# EasyEDA schematic Sheet_1.json
TITLE: Sheet_1; REV: 1.0; Date: 2022-01-21; Sheet: 1/1; Drawn By: reutadm; Company: Your Company
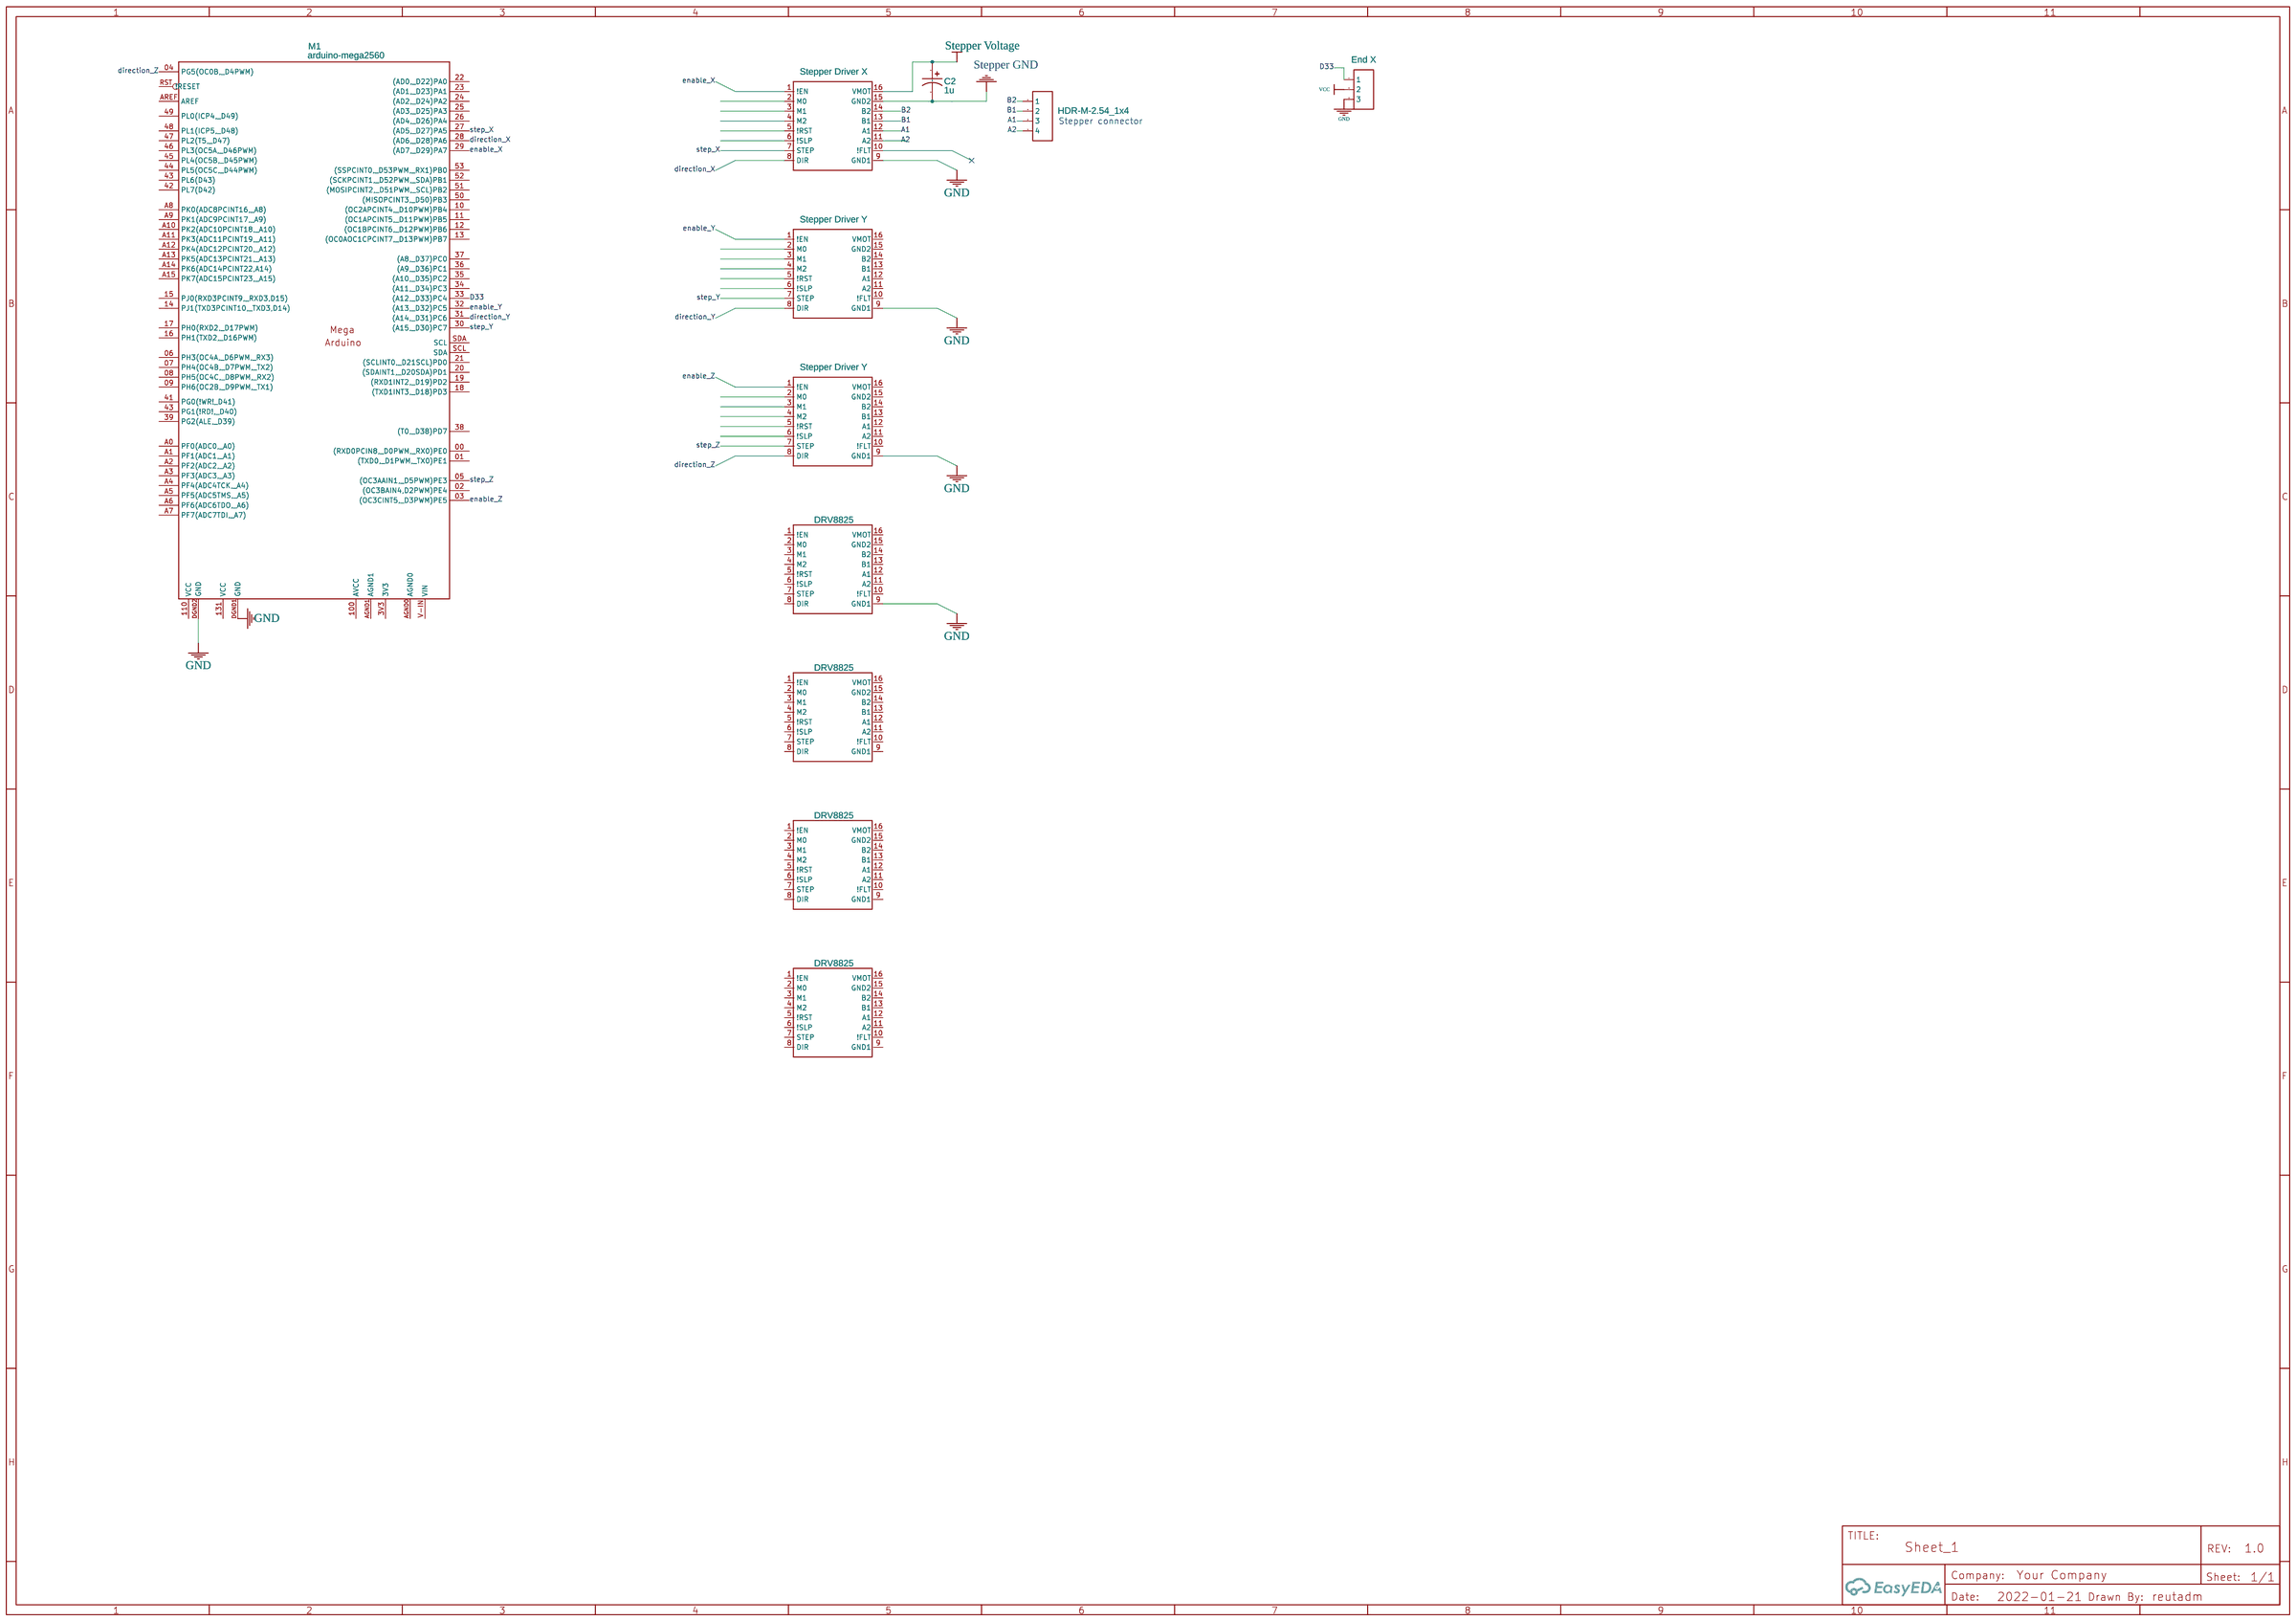
[diagram p0: schematic sheet]

## Parts
C2  1u  [CAP-D3.0×F1.5]
H1  End X  [HDR-F-2.54_1X3]
IC1  Stepper Driver X  [DRV8825]
IC2  Stepper Driver Y  [DRV8825]
IC3  Stepper Driver Y  [DRV8825]
IC4  DRV8825  [DRV8825]
IC5  DRV8825  [DRV8825]
IC6  DRV8825  [DRV8825]
IC7  DRV8825  [DRV8825]
J1  HDR-M-2.54_1x4  [HDR-M-2.54_1X4]
M1  arduino-mega2560  [ARDUINO-MEGA2560]

## Library data of the parts
C2 = CE_TH_D3.0×F1.5_US: Contributor: LCEDA_Lib
H1 = HDR-F-2.54_1x3: Supplier Part: C146690; Supplier: LCSC; Contributor: LCEDA_Lib
IC1-IC7 = 2133-DRV8825: Contributor: aidancor
J1 = HDR-M-2.54_1x4: Supplier Part: C124378; Supplier: LCSC; Contributor: LCEDA_Lib
M1 = arduino-mega2560: subpart_no: 1; Contributor: hg5cfj

## Nets
GND: H1.3 IC1.9(GND1) IC2.9(GND1) IC3.9(GND1) IC4.9(GND1) M1.DGND1(GND) M1.DGND2(GND)
VCC: H1.2
A1: IC1.12(A1) J1.3
A2: IC1.11(A2) J1.4
B1: IC1.13(B1) J1.2
B2: IC1.14(B2) J1.1
D33: H1.1 M1.33((A12, D33)PC4)
direction_X: IC1.8(DIR) M1.28((AD6, D28)PA6)
direction_Y: IC2.8(DIR) M1.31((A14, D31)PC6)
direction_Z: IC3.8(DIR) M1.04(PG5(OC0B, D4PWM))
enable_X: IC1.1(!EN) M1.29((AD7, D29)PA7)
enable_Y: IC2.1(!EN) M1.32((A13, D32)PC5)
enable_Z: IC3.1(!EN) M1.03((OC3CINT5, D3PWM)PE5)
step_X: IC1.7(STEP) M1.27((AD5, D27)PA5)
step_Y: IC2.7(STEP) M1.30((A15, D30)PC7)
step_Z: IC3.7(STEP) M1.05((OC3AAIN1, D5PWM)PE3)
Stepper GND: C2.2 IC1.15(GND2)
Stepper Voltage: C2.1 IC1.16(VMOT)

Not connected (* = marked no-connect by the designer): IC1 2(M0) 3(M1) 4(M2) 5(!RST) 6(!SLP) 10(!FLT); IC2 2(M0) 3(M1) 4(M2) 5(!RST) 6(!SLP) 10(!FLT) 11(A2) 12(A1) 13(B1) 14(B2) 15(GND2) 16(VMOT); IC3 2(M0) 3(M1) 4(M2) 5(!RST) 6(!SLP) 10(!FLT) 11(A2) 12(A1) 13(B1) 14(B2) 15(GND2) 16(VMOT); IC4 1(!EN) 2(M0) 3(M1) 4(M2) 5(!RST) 6(!SLP) 7(STEP) 8(DIR) 10(!FLT) 11(A2) 12(A1) 13(B1) 14(B2) 15(GND2) 16(VMOT); IC5 1(!EN) 2(M0) 3(M1) 4(M2) 5(!RST) 6(!SLP) 7(STEP) 8(DIR) 9(GND1) 10(!FLT) 11(A2) 12(A1) 13(B1) 14(B2) 15(GND2) 16(VMOT); IC6 1(!EN) 2(M0) 3(M1) 4(M2) 5(!RST) 6(!SLP) 7(STEP) 8(DIR) 9(GND1) 10(!FLT) 11(A2) 12(A1) 13(B1) 14(B2) 15(GND2) 16(VMOT); IC7 1(!EN) 2(M0) 3(M1) 4(M2) 5(!RST) 6(!SLP) 7(STEP) 8(DIR) 9(GND1) 10(!FLT) 11(A2) 12(A1) 13(B1) 14(B2) 15(GND2) 16(VMOT); M1 00((RXD0PCIN8, D0PWM, RX0)PE0) 01((TXD0, D1PWM, TX0)PE1) 02((OC3BAIN4,D2PWM)PE4) 3V3 06(PH3(OC4A, D6PWM, RX3)) 07(PH4(OC4B, D7PWM, TX2)) 08(PH5(OC4C, D8PWM, RX2)) 09(PH6(OC2B, D9PWM, TX1)) 10((OC2APCINT4, D10PWM)PB4) 11((OC1APCINT5, D11PWM)PB5) 12((OC1BPCINT6, D12PWM)PB6) 13((OC0AOC1CPCINT7, D13PWM)PB7) 14(PJ1(TXD3PCINT10, TXD3,D14)) 15(PJ0(RXD3PCINT9, RXD3,D15)) 16(PH1(TXD2, D16PWM)) 17(PH0(RXD2, D17PWM)) 18((TXD1INT3, D18)PD3) 19((RXD1INT2, D19)PD2) 20((SDAINT1, D20SDA)PD1) 21((SCLINT0, D21SCL)PD0) 22((AD0, D22)PA0) 23((AD1, D23)PA1) 24((AD2, D24)PA2) 25((AD3, D25)PA3) 26((AD4, D26)PA4) 34((A11, D34)PC3) 35((A10, D35)PC2) 36((A9, D36)PC1) 37((A8, D37)PC0) 38((T0, D38)PD7) 39(PG2(ALE, D39)) 41(PG0(!WR! D41)) 42(PL7(D42)) 43(PL6(D43)) 44(PL5(OC5C, D44PWM)) 45(PL4(OC5B, D45PWM)) 46(PL3(OC5A, D46PWM)) 47(PL2(T5, D47)) 48(PL1(ICP5, D48)) 49(PL0(ICP4, D49)) 50((MISOPCINT3, D50)PB3) 51((MOSIPCINT2, D51PWM, SCL)PB2) 52((SCKPCINT1, D52PWM, SDA)PB1) 53((SSPCINT0, D53PWM, RX1)PB0) 100(AVCC) 110(VCC) 131(VCC) A0(PF0(ADC0, A0)) A1(PF1(ADC1, A1)) A2(PF2(ADC2, A2)) A3(PF3(ADC3, A3)) A4(PF4(ADC4TCK, A4)) A5(PF5(ADC5TMS, A5)) A6(PF6(ADC6TDO, A6)) A7(PF7(ADC7TDI, A7)) A8(PK0(ADC8PCINT16, A8)) A9(PK1(ADC9PCINT17, A9)) A10(PK2(ADC10PCINT18, A10)) A11(PK3(ADC11PCINT19, A11)) A12(PK4(ADC12PCINT20, A12)) A13(PK5(ADC13PCINT21, A13)) A14(PK6(ADC14PCINT22,A14)) A15(PK7(ADC15PCINT23, A15)) AGND0 AGND1 AREF RST(!RESET) SCL(SDA) SDA(SCL) V-IN(VIN)

## Notes on the sheet
- Stepper connector
